# Altium schematic sheet Sheet1.SchDoc
size A
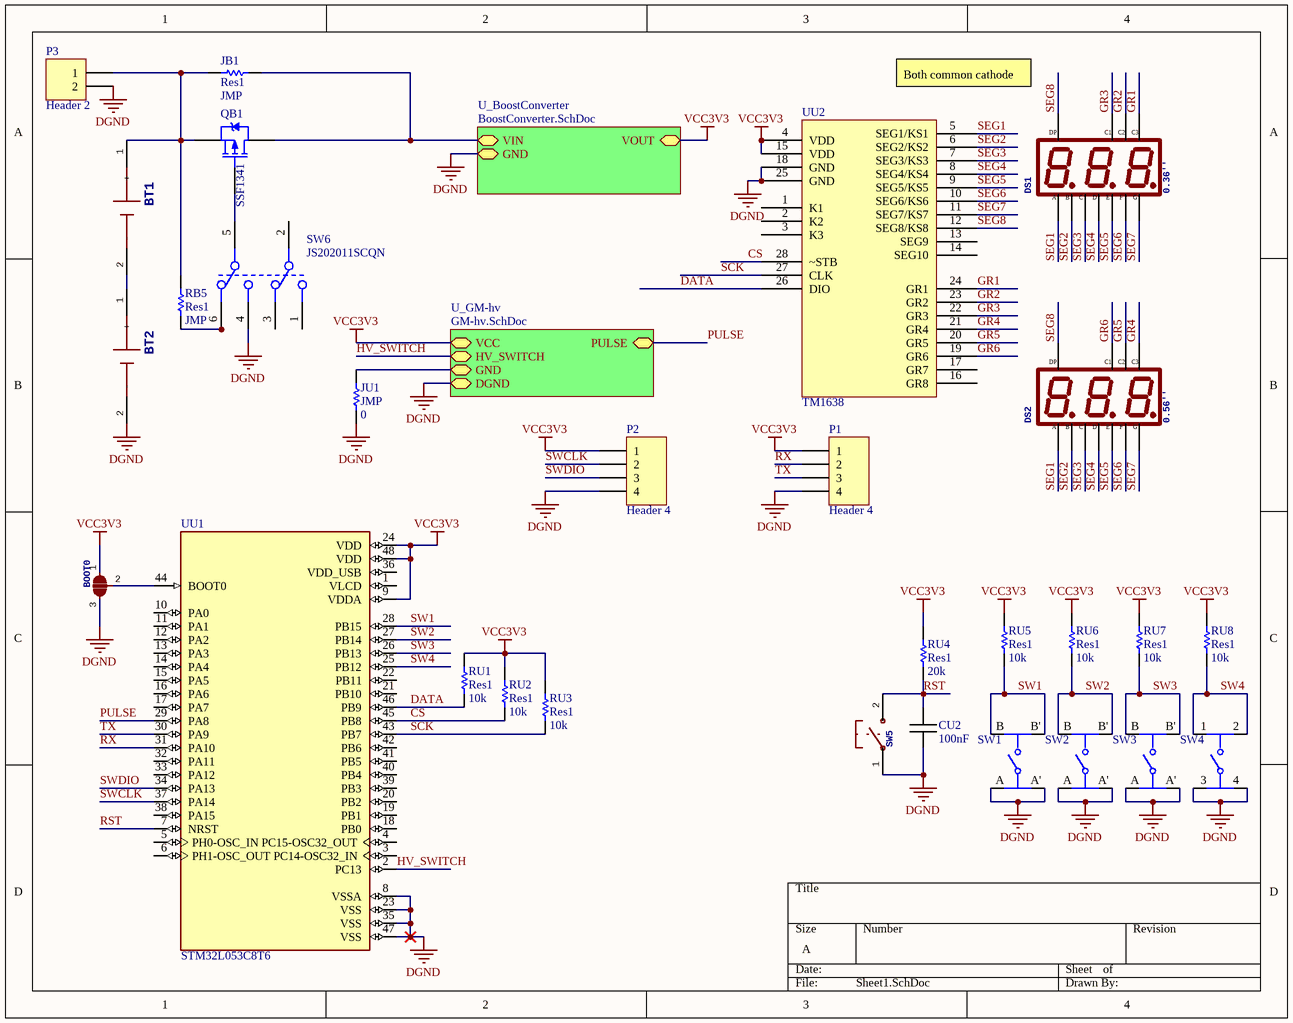
[diagram p0: Sheet1.SchDoc]

## Parts
BOOT0  2-Way Solder Jumper  [SOLDERJUMPER_2WAY_OPEN_NOPASTE]  (value not drawn)
BT1  Holder Cr2032 Gold Leads Smd  [AAA holder smd]  (value not drawn)
BT2  Holder Cr2032 Gold Leads Smd  [AAA holder smd]  (value not drawn)
CU2  100nF  [CAP0603R]
DS1  0.36''  [7-seg 3bit 0.36]
DS2  0.56''  [BA56-12EWA]
JB1  Res1  value JMP  [RES0603R]
JU1  JMP  value 0  [RES0603R]
P1  Header 4  [HDR1X4]
P2  Header 4  [HDR1X4]
P3  Header 2  [HDR1X2]
QB1  SSF1341  [SOT23]
RB5  Res1  value JMP  [RES0603R]
RU1  Res1  value 10k  [RES0603R]
RU2  Res1  value 10k  [RES0603R]
RU3  Res1  value 10k  [RES0603R]
RU4  Res1  value 20k  [RES0603R]
RU5  Res1  value 10k  [RES0603R]
RU6  Res1  value 10k  [RES0603R]
RU7  Res1  value 10k  [RES0603R]
RU8  Res1  value 10k  [RES0603R]
SW1  EVQ-PAE05R  [FP-EVQ-PAE05R-MFG]  (value not drawn)
SW2  EVQ-PAE05R  [FP-EVQ-PAE05R-MFG]  (value not drawn)
SW3  EVQ-PAE05R  [FP-EVQ-PAE05R-MFG]  (value not drawn)
SW4  FSM100  [FP-FSM100-MFG]  (value not drawn)
SW5  Switch  [PUSH_SMD_3x4]  (value not drawn)
SW6  JS202011SCQN  [JS202011SCQN]
UU1  STM32L053C8T6  [LQFP48_7X7MM_0.5MMPP]
UU2  TM1638  [SOP-28]

## Sub-sheets
U_BoostConverter = BoostConverter.SchDoc: VIN (bidir), GND (bidir), VOUT (bidir)
U_GM-hv = GM-hv.SchDoc: VCC (bidir), GND (bidir), PULSE (bidir), HV_SWITCH (bidir), DGND (bidir)

## Nets
DGND: BOOT0.3 BT2.2(-) CU2.2 JU1.1 P1.4 P2.4 P3.2 SW1.A SW1.A' SW2.A SW2.A' SW3.A SW3.A' SW4.3 SW4.4 SW5.1(P$1) SW6.4 UU1.8(VSSA) UU1.23(VSS) UU1.35(VSS) UU1.47(VSS) UU2.18(GND) UU2.25(GND) ; sheet U_GM-hv/DGND, sheet U_BoostConverter/GND
VCC3V3: BOOT0.1 P1.1 P2.1 RU1.2 RU2.1 RU3.1 RU4.1 RU5.2 RU6.2 RU7.2 RU8.2 UU1.9(VDDA) UU1.24(VDD) UU1.48(VDD) UU2.4(VDD) UU2.15(VDD) ; sheet U_GM-hv/VCC, sheet U_BoostConverter/VOUT
CS: RU2.2 UU1.45(PB8) UU2.28(~STB)
DATA: RU1.1 UU1.46(PB9) UU2.26(DIO)
GR1: DS1.12(CA@3) UU2.24(GR1)
GR2: DS1.9(CA@2) UU2.23(GR2)
GR3: DS1.8(CA@1) UU2.22(GR3)
GR4: DS2.12(CA@3) UU2.21(GR4)
GR5: DS2.9(CA@2) UU2.20(GR5)
GR6: DS2.8(CA@1) UU2.19(GR6)
HV_SWITCH: UU1.2(PC13) ; sheet U_GM-hv/HV_SWITCH
PULSE: UU1.29(PA8) ; sheet U_GM-hv/PULSE
RST: CU2.1 RU4.2 SW5.2(P$2) UU1.7(NRST)
RX: P1.2 UU1.31(PA10)
SCK: RU3.2 UU1.43(PB7) UU2.27(CLK)
SEG1: DS1.11(A) DS2.11(A) UU2.5(SEG1/KS1)
SEG2: DS1.7(B) DS2.7(B) UU2.6(SEG2/KS2)
SEG3: DS1.4(C) DS2.4(C) UU2.7(SEG3/KS3)
SEG4: DS1.2(D) DS2.2(D) UU2.8(SEG4/KS4)
SEG5: DS1.1(E) DS2.1(E) UU2.9(SEG5/KS5)
SEG6: DS1.10(F) DS2.10(F) UU2.10(SEG6/KS6)
SEG7: DS1.5(G) DS2.5(G) UU2.11(SEG7/KS7)
SEG8: DS1.3(DP) DS2.3(DP) UU2.12(SEG8/KS8)
SW1: RU5.1 SW1.B SW1.B' UU1.28(PB15)
SW2: RU6.1 SW2.B SW2.B' UU1.27(PB14)
SW3: RU7.1 SW3.B SW3.B' UU1.26(PB13)
SW4: RU8.1 SW4.1 SW4.2 UU1.25(PB12)
SWCLK: P2.2 UU1.37(PA14)
SWDIO: P2.3 UU1.34(PA13)
TX: P1.3 UU1.30(PA9)
NetBOOT0_2: BOOT0.2 UU1.44(BOOT0)
NetBT1_1: BT1.1(+) JB1.2 P3.1 QB1.2(S) RB5.1
NetBT1_2: BT1.2(-) BT2.1(+)
NetJB1_1: JB1.1 QB1.3(D) ; sheet U_BoostConverter/VIN
NetJU1_2: JU1.2 ; sheet U_GM-hv/GND
NetQB1_1: QB1.1(G) SW6.5
NetRB5_2: RB5.2 SW6.6

Not connected (* = marked no-connect by the designer): SW6 1 2 3; UU1 1(VLCD) 3(PC14-OSC32_IN) 4(PC15-OSC32_OUT) 5(PH0-OSC_IN) 6(PH1-OSC_OUT) 10(PA0) 11(PA1) 12(PA2) 13(PA3) 14(PA4) 15(PA5) 16(PA6) 17(PA7) 18(PB0) 19(PB1) 20(PB2) 21(PB10) 22(PB11) 32(PA11) 33(PA12) 36(VDD_USB) 38(PA15) 39(PB3) 40(PB4) 41(PB5) 42(PB6); UU2 1(K1) 2(K2) 3(K3) 13(SEG9) 14(SEG10) 16(GR8) 17(GR7)

## Notes on the sheet
- Both common cathode
- (in symbol BA56-12EWA) C1; C2; C3

## Library data of the parts
BOOT0 = SOLDERJUMPER_2WAY0603
BT1 BT2 = BU2032SM-BT-GTR: MF: MPD; Price: 0.64 USD; Package: None; Availability: Good; MP: BU2032SM-BT-GTR
CU2 = Capacitor
DS1 DS2 = BA56-12EWA: MF: Kingbright; MP: BA56-12EWA; Availability: Good; Package: DIP-12 Kingbright; Price: 2.42 USD
JB1 JU1 RB5 RU1-RU8 = Res1: Resistor; Published: 8-Jun-2000; LatestRevisionDate: 17-Jul-2002; LatestRevisionNote: Re-released for DXP Platform.; PackageReference: AXIAL-0.3; Publisher: Altium Limited; PackageDescription: Axial Device, Thru-Hole; 2 Leads; 0.3 in Pin Spacing
P1 P2 = Header 4: Header, 4-Pin; LatestRevisionDate: 17-Jul-2002; LatestRevisionNote: Re-released for DXP Platform.; Publisher: Altium Limited
P3 = Header 2: Header, 2-Pin; LatestRevisionDate: 17-Jul-2002; LatestRevisionNote: Re-released for DXP Platform.; Publisher: Altium Limited
QB1 = PMOS: P-Channel Power MOSFET PMV65XP; Part Number: 1758119; Package: SOT23; Supplier: Farnell; ComponentLink1Description: Datasheet; ComponentLink1URL: http://www.farnell.com/datasheets/1719226.pdf
SW1-SW3 = CMP-05618-000051-1: SWITCH TACTILE SPST-NO 0.02A 15V; Contact Resistance: 50mR; Max Current Rating: 20mA; Electrical Life: 100000Cycles; Throw Configuration: SPST; Operating Force: 1.6N; Actuator Color: Red; Switch Travel: 0.25mm; Actuator Length: 1.1mm; Switch Function: Off-Mom; Illumination Type: Non-Illuminated; Actuator Type: Standard; Lead Free: Lead Free; Max Voltage Rating (DC): 15V; Package Quantity: 500; Packaging: Bulk; Depth: 7.8mm; Series: EVQPA; Radiation Hardening: No; Width: 6mm; Length: 6mm; Contact Current Rating: 20mA; Current Rating: 20mA; Min Operating Temperature: -20°C; Mechanical Life: 100000Cycles; Size: 6mm; Voltage Rating (DC): 15V; Mount: Through Hole; Contact Plating: Gold; Termination: PC Pin; Height: 5mm; Orientation: Straight; Max Operating Temperature: 70°C; Color: Red
SW4 = CMP-03402-000014-1: SWITCH TACTILE SPST-NO 0.05A 24V; Throw Configuration: SPST; Max Current Rating: 50mA; Switch Function: Off-Mom; Actuator Length: 6.35mm; Electrical Life: 100000Cycles; Max Voltage Rating (DC): 12V; Switch Travel: 0.3mm; Illumination Type: Non-Illuminated; Actuator Material: Polyester; Actuator Type: Standard; Actuator Color: Black; Contact Resistance: 100mR; Operating Force: 1.57N; Orientation: Straight; Contact Type: 1 maker; Current Rating: 50mA; Termination: PC Pins; Contact Current Rating: 50mA; Max Operating Temperature: 85°C; RoHS Compliant: Yes; Min Operating Temperature: -35°C; Contact Plating: Silver; Length: 12mm; Voltage Rating (DC): 24V; Type: Switch; Packaging: Loose Piece; Series: FSM100 ~ 104; Contact Material: Copper Alloy; Depth: 12.5mm; Lead Free: Lead Free; Mount: Through Hole; ELV: Compliant; Package Quantity: 400; Mechanical Life: 100000Cycles
SW5 = B3U-1000P: MANUFACTURER: Omron; DIGIKEY: SW1020CT-ND; MPN: B3U-1000P
SW6 = JS202011SCQN: SWITCH SLIDE DPDT 300MA 6V; Actuator Material: Nylon; Actuator Length: 2mm; Actuator Type: Standard; Contact Resistance: 70mR; Switch Function: On-On; Electrical Life: 5000Cycles; Voltage Rating (DC): 6V; Contact Current Rating: 300mA; Contact Plating: Silver; Throw Configuration: DPDT; REACH SVHC: No SVHC; Length: 9mm; Package Quantity: 1; Min Operating Temperature: -20°C; Contact Material: Copper Alloy; Switch Travel: 2mm; Radiation Hardening: No; Depth: 7.5mm; Packaging: Tape and Reel; Max Voltage Rating (DC): 6V; Housing Material: Nylon; Max Operating Temperature: 85°C; Current Rating: 300mA; Orientation: Vertical; Termination: Gull Wing; Flammability Rating: UL94 V-2; Lead Free: Lead Free; Mount: Surface Mount; Max Current Rating: 300mA
UU1 = STM32L053C8T6: ARMÂ® CortexÂ®-M0+ STM32L0 Microcontroller IC 32-Bit 32MHz 64KB _64K x 8_ FLASH 48-LQFP _7x7_; MF: STMicroelectronics; SnapEDA_Link: https://www.snapeda.com/parts/STM32L053C8T6/STMicroelectronics/view-part/552329/?ref=snap; Digi-Key_Purchase_URL: https://www.digikey.nl/product-detail/en/stmicroelectronics/STM32L053C8T6/497-14906-ND/4935255?utm_source=snapeda&utm_medium=aggregator&utm_campaign=symbol; MP: STM32L053C8T6; Digi-Key_Part_Number: 497-14906-ND; Value: *; Package: LQFP-48 STMicroelectronics
UU2 = TM1638: 7Seg and keyboard driver